# EAGLE design AutonomousSensorBoard V1 (EAGLE 8.4.1)
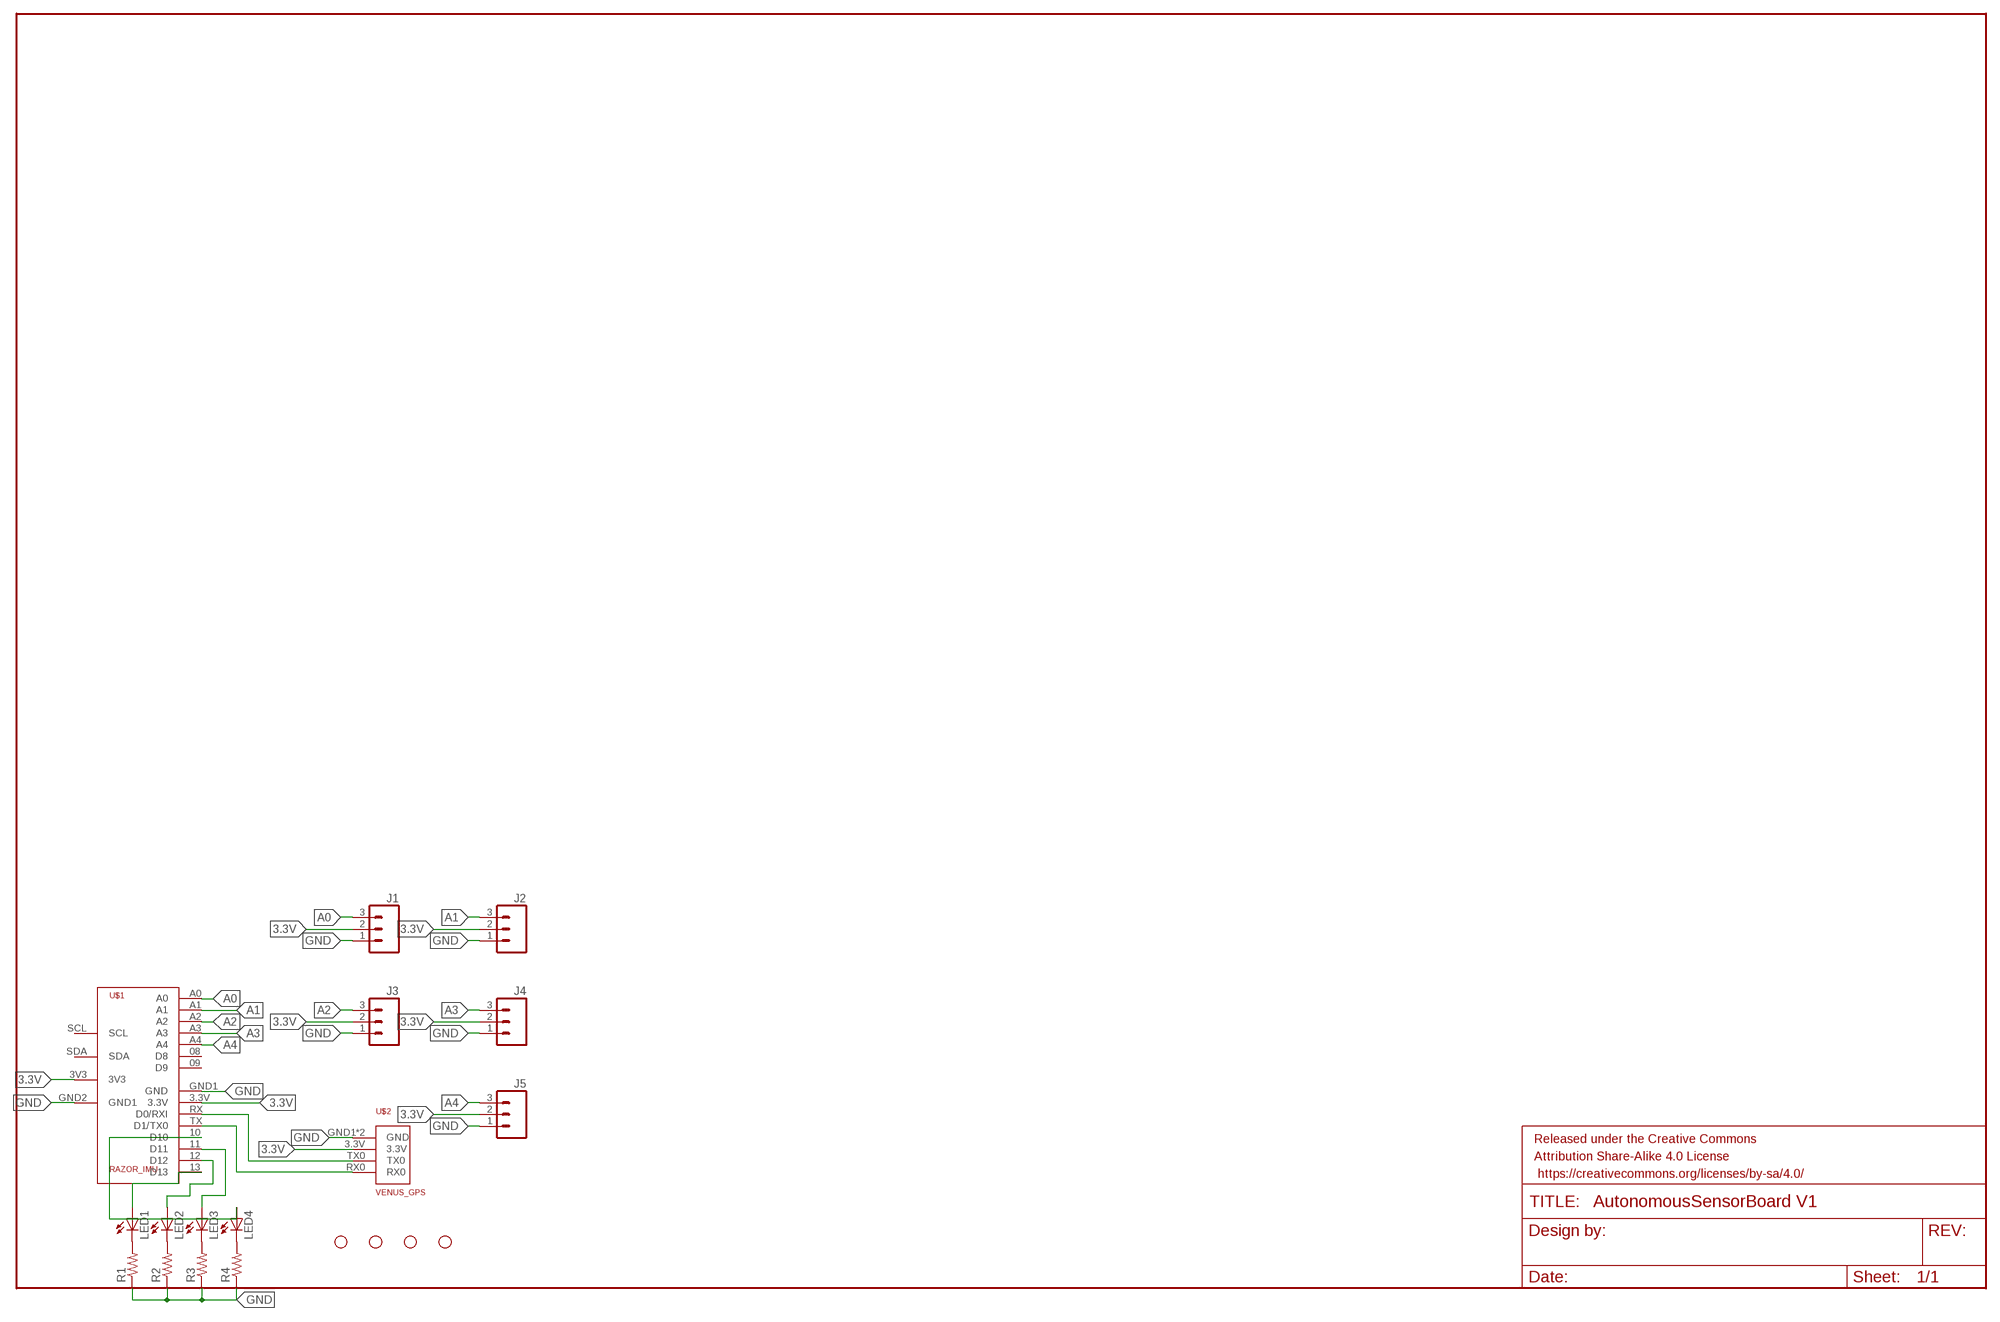
[diagram p0: schematic, sheet 1]

## Parts
FRAME1  FRAME-LEDGER  [CREATIVE_COMMONS]
H1  STAND-OFF  [STAND-OFF]
H2  STAND-OFF  [STAND-OFF]
H3  STAND-OFF  [STAND-OFF]
H4  STAND-OFF  [STAND-OFF]
J1  M03LOCK  [1X03_LOCK]
J2  M03LOCK  [1X03_LOCK]
J3  M03LOCK  [1X03_LOCK]
J4  M03LOCK  [1X03_LOCK]
J5  M03LOCK  [1X03_LOCK]
LED1  LEDCHIP-LED0805  [CHIP-LED0805]
LED2  LEDCHIP-LED0805  [CHIP-LED0805]
LED3  LEDCHIP-LED0805  [CHIP-LED0805]
LED4  LEDCHIP-LED0805  [CHIP-LED0805]
R1  R-US_M0805  [M0805]
R2  R-US_M0805  [M0805]
R3  R-US_M0805  [M0805]
R4  R-US_M0805  [M0805]
U$1  RAZOR_IMU  [RAZOR_IMU]
U$2  VENUS_GPS  [VENUS_GPS]

## Nets
3.3V: J1.2 J2.2 J3.2 J4.2 J5.2 U$1.3.3V U$1.3V3 U$2.3.3V
A0: J1.3 U$1.A0
A1: J2.3 U$1.A1
A2: J3.3 U$1.A2
A3: J4.3 U$1.A3
A4: J5.3 U$1.A4
GND: J1.1 J2.1 J3.1 J4.1 J5.1 R1.1 R2.1 R3.1 R4.1 U$1.GND1(GND) U$1.GND2(GND1) U$2.GND1(GND) U$2.GND2(GND)
N$1: U$1.RX(D0/RXI) U$2.TX0
N$2: U$1.TX(D1/TX0) U$2.RX0
N$3: LED1.C R1.2
N$4: LED2.C R2.2
N$5: LED4.C R4.2
N$6: LED3.C R3.2
N$7: LED2.A U$1.12(D12)
N$8: LED1.A U$1.13(D13)
N$9: LED3.A U$1.11(D11)
N$10: LED4.A U$1.10(D10)
Unconnected: U$1.08(D8) U$1.09(D9) U$1.SCL U$1.SDA

## Library data of the parts
FRAME1 = SparkFun-Aesthetics:FRAME-LEDGER: Schematic Frame Standard 11x14 US Ledger frame
H1-H4 = SparkFun-Electromechanical:STAND-OFF: #4 Stand Off This is the mechanical footprint for a #4 phillips button head screw. Use the keepout ring to avoid running the screw head into surrounding components. SKU : PRT-00447
J1-J5 = SparkFun-Connectors:M03: Header 3 Standard 3-pin 0.1" header. Use with straight break away headers (SKU : PRT-00116), right angle break away headers (PRT-00553), swiss pins (PRT-00743), machine pins (PRT-00117), and female headers (PRT-00115). Molex polarized connector foot print use with SKU : PRT-08232 with associated crimp pins and housings.
LED1-LED4 = led:LED: LED OSRAM: - CHIPLED LG R971, LG N971, LY N971, LG Q971, LY Q971, LO R971, LY R971 LH N974, LH R974 LS Q976, LO Q976, LY Q976 LO Q996 - Hyper CHIPLED LW Q18S LB Q993, LB Q99A, LB R99A - SideLED LS A670, LO A670, LY A670, LG A670, LP A670 LB A673, LV A673, LT A673, LW A673 LH A674 LY A675 LS A676, LA A676, LO A676, LY A676, LW A676 LS A679, LY A679, LG A679 - Hyper Micro SIDELED® LS Y876, LA Y876, LO Y876, LY Y876 LT Y87S - SmartLED LW L88C, LW L88S LB L89C, LB L89S, LG L890 LS L89K, LO L89K, LY L89K LS L896, LA L896, LO L896, LY L896 - TOPLED LS T670, LO T670, LY T670, LG T670, LP T670 LSG T670, LSP T670, LSY T670, LOP T670, LYG T670 LG T671, LOG T671, LSG T671 LB T673, LV T673, LT T673, LW T673 LH T674 LS T676, LA T676, LO T676, LY T676, LB T676, LH T676, LSB T676, LW T676 LB T67C, LV T67C, LT T67C, LS T67K, LO T67K, LY T67K, LW E67C LS E67B, LA E67B, LO E67B, LY E67B, LB E67C, LV E67C, LT E67C LW T67C LS T679, LY T679, LG T679 LS T770, LO T770, LY T770, LG T770, LP T770 LB T773, LV T773, LT T773, LW T773 LH T774 LS E675, LA E675, LY E675, LS T675 LS T776, LA T776, LO T776, LY T776, LB T776 LHGB T686 LT T68C, LB T68C - Hyper Mini TOPLED® LB M676 - Mini TOPLED Santana® LG M470 LS M47K, LO M47K, LY M47K Source: http://www.osram.convergy.de LUXEON: - LUMILED® LXK2-PW12-R00, LXK2-PW12-S00, LXK2-PW14-U00, LXK2-PW14-V00 LXK2-PM12-R00, LXK2-PM12-S00, LXK2-PM14-U00 LXK2-PE12-Q00, LXK2-PE12-R00, LXK2-PE12-S00, LXK2-PE14-T00, LXK2-PE14-U00 LXK2-PB12-K00, LXK2-PB12-L00, LXK2-PB12-M00, LXK2-PB14-N00, LXK2-PB14-P00, LXK2-PB14-Q00 LXK2-PR12-L00, LXK2-PR12-M00, LXK2-PR14-Q00, LXK2-PR14-R00 LXK2-PD12-Q00, LXK2-PD12-R00, LXK2-PD12-S00 LXK2-PH12-R00, LXK2-PH12-S00 LXK2-PL12-P00, LXK2-PL12-Q00, LXK2-PL12-R00 Source: www.luxeon.com KINGBRIGHT: KA-3528ASYC Source: www.kingbright.com
R1-R4 = resistor:R-US_: RESISTOR, American symbol
U$1 = Razor_IMU:RAZOR_IMU
U$2 = Venus_GPS:VENUS_GPS: EAGLE FOOT-PRINT FOR VENUS_GPS BREAKOUT BOARD

## Board
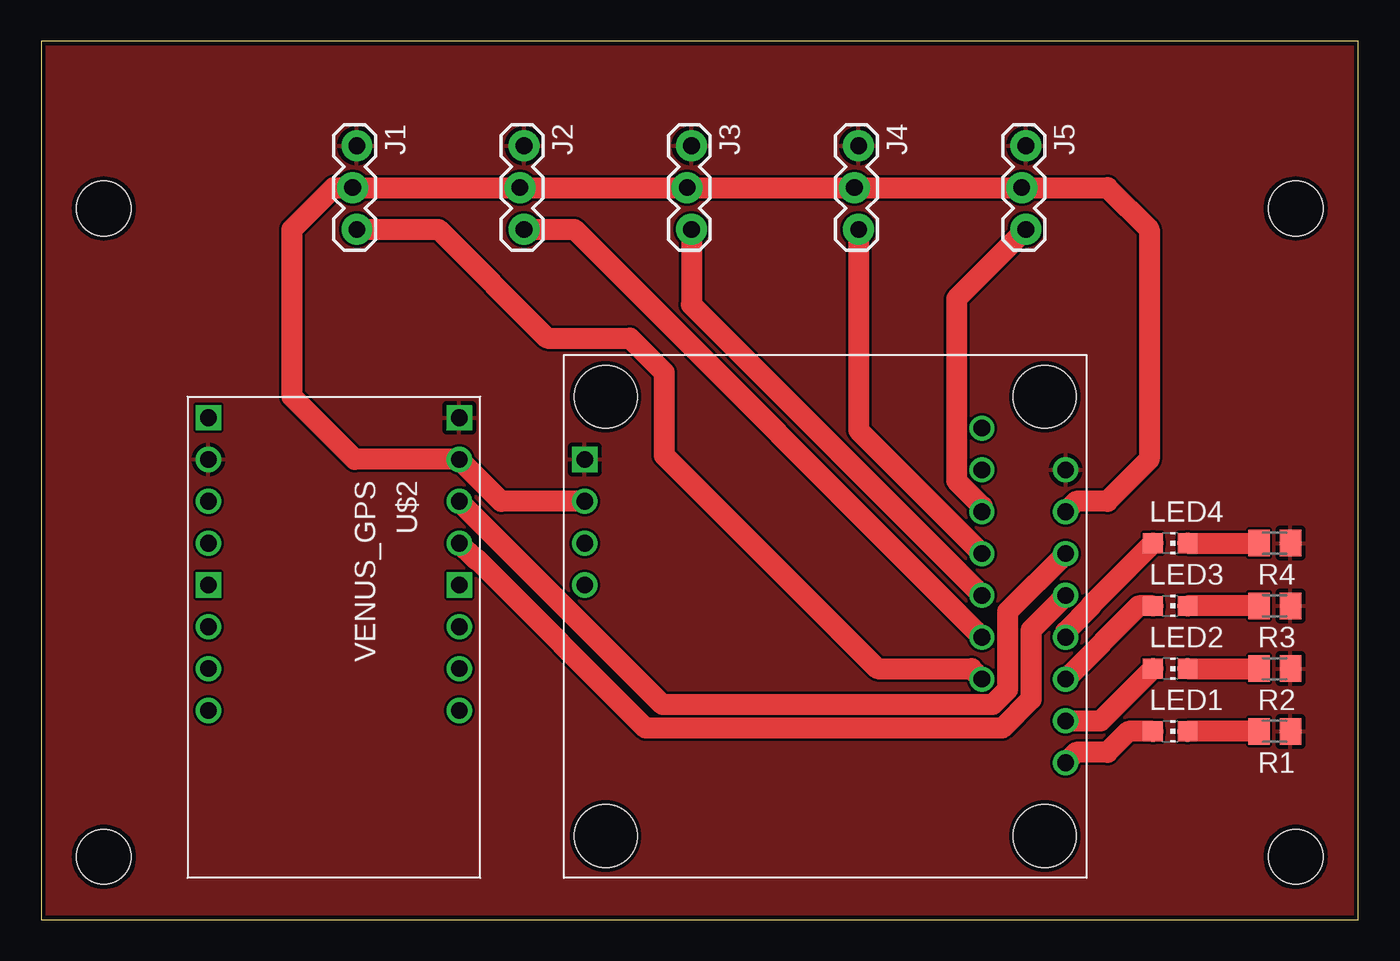
[diagram p1: board, top side]
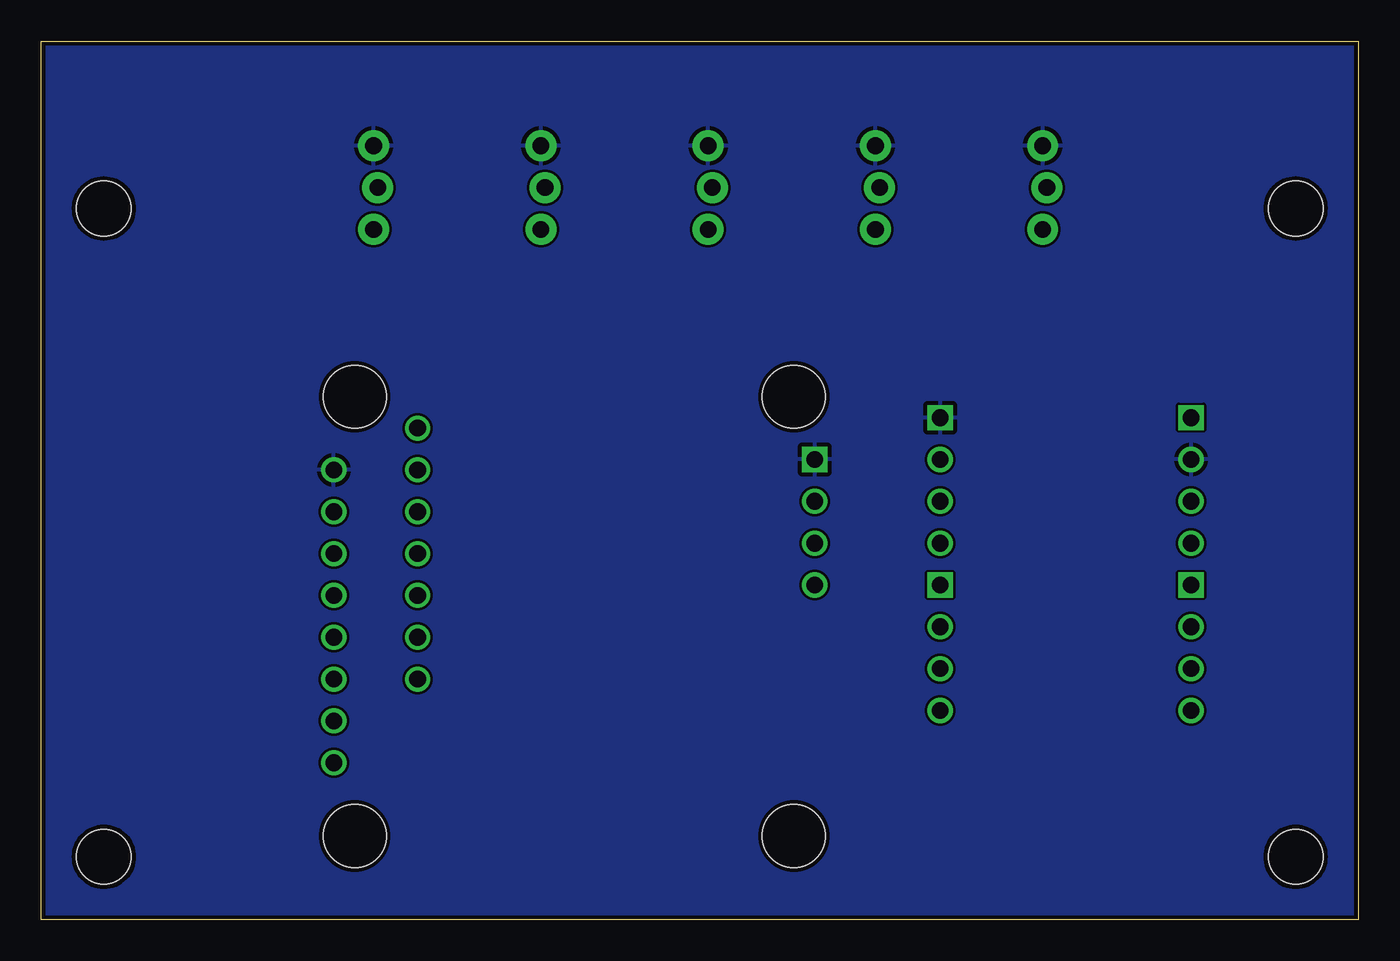
[diagram p2: board, bottom side, seen from below]

Size 80.01 x 53.34 mm. Coordinates in mm from the lower left corner, seen from the top.
Outline: 0,0 80.01,0 80.01,53.34 0,53.34 0,0
Copper layers (1*16): Top 0.035mm / dielectric 1.5mm / Bottom 0.035mm
Design rules "SeeedStudio_2layer_DRU_no_angle_20140221": minimum track width 6mil, minimum drill 12mil, track to track 6mil, track to pad 6mil, pad to pad 6mil, via to via 6mil, smd to smd 0mil, copper to edge 10mil, drill to drill 10mil, minimum pad ring 10mil, minimum via ring 6mil, stop-mask expansion 2mil, vias tented up to drill 100mil, thermal gap 10mil

### Footprints (pad centres in the part's own frame; a part is rotated, then mirrored left to right if it is on the bottom)
STAND-OFF = hole 3.302: 0,0
1X03_LOCK = drill 1.016 pad 1.88: 1 0,0.127; 2 2.54,-0.127; 3 5.08,0.127
CHIP-LED0805 = smd 1.2 x 1.2: A 0,-1.05; C 0,1.05
M0805 = smd 1.3 x 1.6: 1 -0.95,0; 2 0.95,0
RAZOR_IMU = drill 1.016: 3.3V 1.27,22.86; 3V3 30.48,22.225; 08 25.4,24.765; 09 25.4,27.305; 10 30.48,14.605; 11 30.48,12.065; 12 30.48,9.525; 13 30.48,6.985; A0 25.4,12.065; A1 25.4,14.605; A2 25.4,17.145; A3 25.4,19.685; A4 25.4,22.225; GND2 30.48,24.765; RX 30.48,19.685; SCL 1.27,17.78; SDA 1.27,20.32; TX 30.48,17.145 | drill 1.016 square: GND1 1.27,25.4 | hole 3.81: 2.54,29.21; 2.54,2.54; 29.21,2.54; 29.21,29.21
VENUS_GPS = drill 1.016: 3.3V 3.81,16.51; AD2 19.05,1.27; CLK 13.97,16.51; GND1 3.81,1.27; MISO 16.51,16.51; MOSI 19.05,16.51; NAV 6.35,1.27; PPS 8.89,1.27; RX0 8.89,16.51; SCL 16.51,1.27; TX0 6.35,16.51; TX1 13.97,1.27 | drill 1.016 square: CS 11.43,16.51; GND2 1.27,16.51; RX1 11.43,1.27; VBAT 1.27,1.27

### Placement (x,y rotation side)
FRAME1  20.32,-8.89 0 top  (outside the outline)
H1  3.81,3.81 0 top
H2  3.81,43.18 0 top
H3  76.2,3.81 0 top
H4  76.2,43.18 0 top
J1  19.05,46.99 270 top
J2  29.21,46.99 270 top
J3  39.37,46.99 270 top
J4  49.53,46.99 270 top
J5  59.69,46.99 270 top
LED1  68.58,11.43 270 top
LED2  68.58,15.24 270 top
LED3  68.58,19.05 270 top
LED4  68.58,22.86 270 top
R1  74.93,11.43 180 top
R2  74.93,15.24 180 top
R3  74.93,19.05 180 top
R4  74.93,22.86 180 top
U$1  31.75,2.54 0 top
U$2  8.89,31.75 270 top

### Tracks (layer width: path | path; a pad name or v marks a point on that pad's centre or on a via)
3.3V
  Top 1.27: U$1.3V3 62.87,25.4 64.77,25.4 67.31,27.94 67.31,41.91 64.77,44.45 J5.2 J4.2 J3.2 J2.2 J1.2 17.78,44.45 15.24,41.91 15.24,31.75 19.05,27.94 U$2.3.3V 27.94,25.4 U$1.3.3V
A0
  Top 1.27: J1.3 24.13,41.91 30.73,35.31 35.76,35.31 37.85,33.22 37.85,28.19 50.8,15.24 56.52,15.24 U$1.A0
A1
  Top 1.27: J2.3 32.38,41.91 U$1.A1
A2
  Top 1.27: J3.3 39.5,37.34 U$1.A2
A3
  Top 1.27: J4.3 49.66,29.72 U$1.A3
A4
  Top 1.27: U$1.A4 57.15,25.11 55.6,26.66 55.6,37.69 J5.3
GND
  pour Top: 0,53.34 80.01,53.34 80.01,0 0,0
  pour Bottom: 0,53.34 80.01,53.34 80.01,0 0,0
N$1
  Top 1.27: U$1.RX 58.7,18.69 58.7,13.96 57.79,13.06 37.74,13.06 U$2.TX0
N$2
  Top 1.27: U$2.RX0 26.39,21.87 26.49,21.87 36.72,11.63 58.38,11.63 60.12,13.37 60.12,17.58 U$1.TX
N$3
  Top 1.27: R1.2 LED1.C
N$4
  Top 1.27: LED2.C R2.2
N$5
  Top 1.27: LED4.C R4.2
N$6
  Top 1.27: R3.2 LED3.C
N$7
  Top 1.27: U$1.12 64.36,12.06 LED2.A
N$8
  Top 1.27: LED1.A 66.04,11.43 64.77,10.16 62.87,10.16 U$1.13
N$9
  Top 1.27: LED3.A 66.67,19.05 U$1.11
N$10
  Top 1.27: LED4.A 63.78,19.11 63.78,19.04 62.23,17.49 U$1.10